# EasyEDA Pro project esp32s3-mp4.eprj

# Schematic Schematic1
Board Name: Board1; Create Date: 2025-05-05; Page Name: P1; Project Name: esp32s3-mp4; Schematic Name: Schematic1; Update Date: 2025-05-05; Company: 嘉立创EDA; Page Size: A4; Version: V1.0
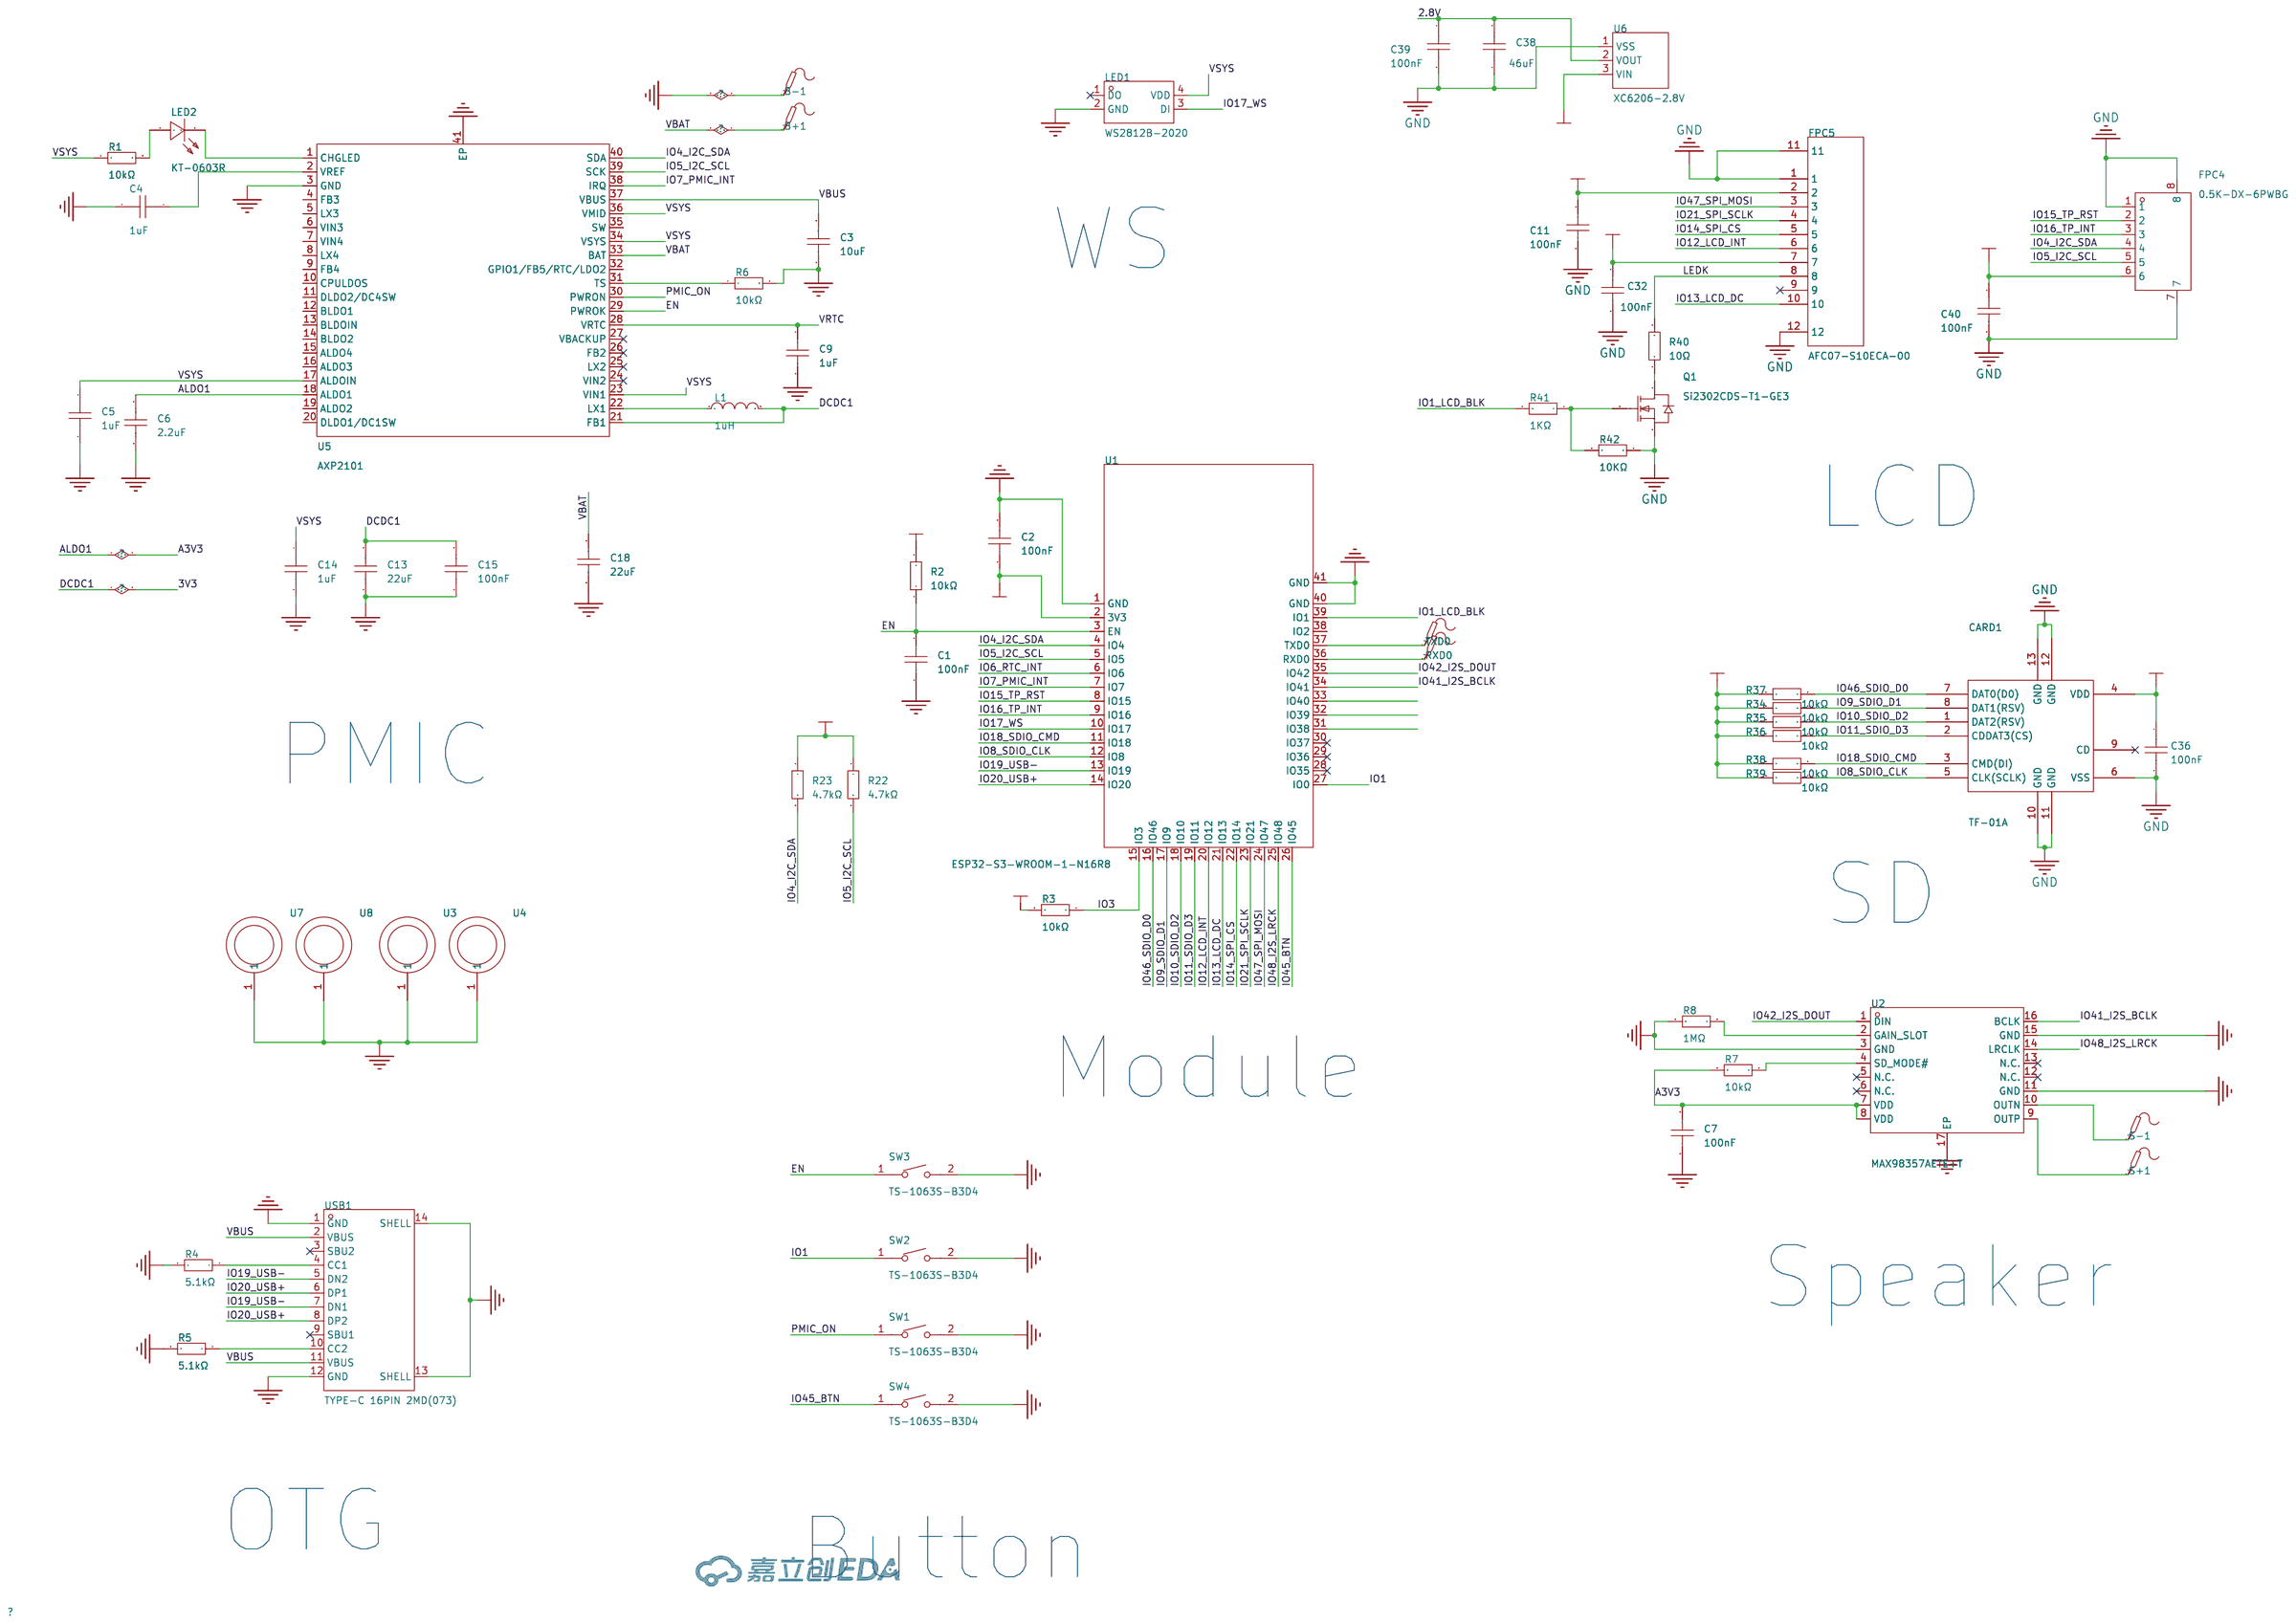
[diagram p0: schematic sheet]

## Parts
B+1  -  [Test-Point-0.5mm]
B-1  -  [Test-Point-0.5mm]
C1  100nF  [C0402]
C2  100nF  [C0402]
C3  10uF  [C0603]
C4  1uF  [C0402]
C5  1uF  [C0402]
C6  2.2uF  [C0402]
C7  100nF  [C0402]
C9  1uF  [C0402]
C11  100nF  [C0402]
C13  22uF  [C0603]
C14  1uF  [C0402]
C15  100nF  [C0402]
C18  22uF  [C0603]
C32  100nF  [C0402]
C36  100nF  [C0402]
C38  46uF  [C0603]
C39  100nF  [C0402]
C40  100nF  [C0402]
CARD1  TF-01A  [TF-SMD_TF-01A]
FPC4  0.5K-DX-6PWBG  [FPC-SMD_6P-P0.50_DEALON_0.5K-DX-6PWB]
FPC5  AFC07-S10ECA-00  [FPC-SMD_P0.50-10P_LCS-SJ-H2.0]
L1  1uH  [IND-SMD_L4.4-W4.2]
LED1  WS2812B-2020  [LED-SMD_4P-L2.0-W2.0-TL_WS2812B-2020]
LED2  KT-0603R  [LED0603-RD]
Q1  Si2302CDS-T1-GE3  [SOT-23_L2.9-W1.3-P1.90-LS2.4-BR]
R1  10kΩ  [R0402]
R2  10kΩ  [R0402]
R3  10kΩ  [R0402]
R4  5.1kΩ  [R0402]
R5  5.1kΩ  [R0402]
R6  10kΩ  [R0402]
R7  10kΩ  [R0402]
R8  1MΩ  [R0402]
R22  4.7kΩ  [R0402]
R23  4.7kΩ  [R0402]
R34  10kΩ  [R0402]
R35  10kΩ  [R0402]
R36  10kΩ  [R0402]
R37  10kΩ  [R0402]
R38  10kΩ  [R0402]
R39  10kΩ  [R0402]
R40  10Ω  [R0402]
R41  1KΩ  [R0402]
R42  10KΩ  [R0402]
RXD0  -  [Test-Point-0.5mm]
S+1  -  [Test-Point-0.5mm]
S-1  -  [Test-Point-0.5mm]
SW1  TS-1063S-B3D4  [KEY-SMD_L3.0-W2.5-LS4.0_TS-1603S]
SW2  TS-1063S-B3D4  [KEY-SMD_L3.0-W2.5-LS4.0_TS-1603S]
SW3  TS-1063S-B3D4  [KEY-SMD_L3.0-W2.5-LS4.0_TS-1603S]
SW4  TS-1063S-B3D4  [KEY-SMD_L3.0-W2.5-LS4.0_TS-1603S]
TXD0  -  [Test-Point-0.5mm]
U1  ESP32-S3-WROOM-1-N16R8  [WIRELM-SMD_ESP32-S3-WROOM-1]
U2  MAX98357AETE+T  [TQFN-16_L3.0-W3.0-P0.50-BL-EP1.5]
U3  -  [M2]
U4  -  [M2]
U5  AXP2101  [QFN-40_L5.0-W5.0-P0.40-TL-EP3.4]
U6  XC6206-2.8V  [SOT-23-3_L2.9-W1.6-P1.90-LS2.8-BR]
U7  -  [M2]
U8  -  [M2]
USB1  TYPE-C 16PIN 2MD(073)  [USB-C-SMD_TYPE-C-6PIN-2MD-073]

## Library data of the parts
B+1 B-1 RXD0 S+1 S-1 TXD0 = Test-Point: Test Point 测试点
C1 C2 C4-C7 C9 C14 C15 = CL05A105KA5NQNC: 容值:1uF;精度:±10%;额定电压:25V;材质(温度系数):X5R;; LCSC Part Name: 1uF ±10% 25V; Supplier Part: C52923; Manufacturer: SAMSUNG(三星); Supplier Footprint: 0402; JLCPCB Part Class: 基础库; Datasheet: https://atta.szlcsc.com/upload/public/pdf/source/20160218/1457707763339.pdf; Supplier: LCSC; Tolerance: ±10%; Voltage Rated: 25V; Temperature Coefficient: X5R
C3 C13 C18 C38 = CL10A226MQ8NRNC: 容值:22uF;精度:±20%;额定电压:6.3V;材质(温度系数):X5R;; LCSC Part Name: 22uF ±20% 6.3V; Supplier Part: C59461; Manufacturer: SAMSUNG(三星); Supplier Footprint: 0603; JLCPCB Part Class: 基础库; Datasheet: https://atta.szlcsc.com/upload/public/pdf/source/20160218/1457707763339.pdf; Supplier: LCSC; Tolerance: ±20%; Voltage Rated: 6.3V; Temperature Coefficient: X5R
C11 C32 C36 C39 C40 = CL05B104KO5NNNC: Capacitance: Tolerance:±10% Tolerance:±10% Voltage Rated: Temperature Coefficient:; LCSC Part Name: 100nF ±10% 16V; Supplier Part: C1525; Manufacturer: SAMSUNG(三星); Supplier Footprint: 0402; JLCPCB Part Class: Basic Part; Datasheet: https://atta.szlcsc.com/upload/public/pdf/source/20160218/1457707763339.pdf; Supplier: LCSC; Tolerance: ±10%
CARD1 = TF-01A_C91145: LCSC Part Name: 自弹式 MicroSD卡(TF卡) 卡座; Supplier Part: C91145; Manufacturer: 韩国韩荣; Supplier Footprint: SMD; JLCPCB Part Class: 扩展库; Datasheet: https://atta.szlcsc.com/upload/public/pdf/source/20190322/C91145_63CBD6FB4639A3A3EC6A9721F18AE0FB.pdf; Supplier: LCSC; Card Connection Mode: 自弹式; Card Type: MicroSD卡(TF卡); Connector Type: 卡座; Supplementary Features: 带定位柱; Maximum Body Height: 1.85mm
FPC4 = 0.5K-DX-6PWBG: LCSC Part Name: 间距:0.5mm P数:6P 翻盖式 下接; Supplier Part: C2911878; Manufacturer: HDGC(华德共创); Supplier Footprint: SMD,P=0.5mm,卧贴; JLCPCB Part Class: 扩展库; Datasheet: https://atta.szlcsc.com/upload/public/pdf/source/20211029/EDC59C5BA257836333CAE013AFC084A6.pdf; Supplier: LCSC; Locking Feature: 翻盖式; Contact Type: 下接; Number of Contacts: 6P; Pitch: 0.5mm; Mounting Type: 卧贴; FFC, FCB Thickness: 0.3mm; Height Above Board: 2mm; Operating Temperature Range: -20℃~+85℃
FPC5 = AFC07-S10ECA-00: LCSC Part Name: 间距:0.5mm P数:10P 抽屉式 上接; Supplier Part: C262583; Manufacturer: JS(钜硕电子); Supplier Footprint: SMD,P=0.5mm,卧贴; JLCPCB Part Class: 扩展库; Datasheet: https://atta.szlcsc.com/upload/public/pdf/source/20190726/C11082_A2E7B12387019CE4314BB5199EE0FDF4.pdf; Supplier: LCSC; Locking Feature: 抽屉式; Contact Type: 上接; Number of Contacts: 10P; Pitch: 0.5mm; Mounting Type: 卧贴; FFC, FCB Thickness: 0.3mm; Height Above Board: 2mm
L1 = FXL0420-2R2-M: 电感值:2.2uH;精度:±20%;额定电流:4.5A;饱和电流(Isat):5A;类型:一体成型电感;; LCSC Part Name: 2.2uH ±20% 5A; Supplier Part: C167206; Manufacturer: cjiang(长江微电); Supplier Footprint: SMD,4.2x4.4mm; JLCPCB Part Class: 扩展库; Datasheet: https://atta.szlcsc.com/upload/public/pdf/source/20240426/3189EA8206330E2108542F9E34E540E7.pdf; Supplier: LCSC; Tolerance: ±20%; Rated Current: 4.5A; Saturation Current (Isat): 5A; DC Resistance (DCR): 58mΩ; Type: 一体成型电感
LED1 = WS2812B-2020: 12mA，小尺寸，高亮，用于小间距，小尺寸产品（注意防潮，请查阅规格书中对应具体内容）; LCSC Part Name: RGB三色; Supplier Part: C965555; Manufacturer: worldsemi; Supplier Footprint: SMD,2x2mm; JLCPCB Part Class: 扩展库; Datasheet: https://atta.szlcsc.com/upload/public/pdf/source/20241202/DEE3FC25B8AD87F3BB1718ACD77EDECD.pdf; Supplier: LCSC; Wavelength: 515.6nm；622.5nm；470.4nm
LED2 = KT-0603R: 发光颜色:红色;功率:-;正向电流:-;主波长:-;二极管配置:-;透镜颜色:-;色温:-;发光角度:-;载带方式:-;工作温度:-40℃~+85℃;; LCSC Part Name: 0603 红灯 高亮; Supplier Part: C2286; Manufacturer: KENTO; Supplier Footprint: 0603; JLCPCB Part Class: 基础库; Datasheet: https://atta.szlcsc.com/upload/public/pdf/source/20160616/1466072038404.pdf; Supplier: LCSC; Emitted Color: 红色; Operating Temperature: -40℃~+85℃
Q1 = Si2302CDS-T1-GE3: LCSC Part Name: 1个N沟道 耐压:20V 电流:2.9A; Supplier Part: C10488; Manufacturer: VISHAY(威世); Supplier Footprint: SOT-23; JLCPCB Part Class: 扩展库; Datasheet: https://atta.szlcsc.com/upload/public/pdf/source/20121215/1457706570095.pdf; Supplier: LCSC; Type: 1个N沟道; Drain Source Voltage (Vdss): 20V; Continuous Drain Current (Id): 2.9A; Drain Source On Resistance (RDS(on)@Vgs,Id): 57mΩ@4.5V,3.6A; Power Dissipation (Pd): 550mW; Gate Threshold Voltage (Vgs(th)@Id): 850mV@250uA; Total Gate Charge (Qg@Vgs): 3.5nC@4.5V; Input Capacitance (Ciss@Vds): 320pF@10V; Reverse Transfer Capacitance (Crss@Vds): 5pF@10V; Operating Temperature: -55℃~+150℃
R1-R8 R22 R23 R34-R42 = 0402WGF1002TCE: 电阻类型:厚膜电阻;阻值:10kΩ;精度:±1%;功率:62.5mW;最大工作电压:50V;温度系数:±100ppm/℃;; LCSC Part Name: 10kΩ ±1% 62.5mW 厚膜电阻; Supplier Part: C25744; Manufacturer: UNI-ROYAL(厚声); Supplier Footprint: 0402; Datasheet: https://atta.szlcsc.com/upload/public/pdf/source/20200306/C422600_1E6D84923E4A46A82E41ADD87F860B5C.pdf; Supplier: LCSC; Type: 厚膜电阻; Tolerance: ±1%; Power(Watts): 62.5mW; Overload Voltage (Max): 50V; Temperature Coefficient: ±100ppm/℃; Operating Temperature Range: -55℃~+155℃
SW1-SW4 = TS-1063S-B3D4: 电路结构:单刀单掷;按钮形状:矩形按钮;作用力:250gf;安装方式:-;带灯:-;机械寿命:-;; LCSC Part Name: 轻触开关3.0*2.5侧按贴片带柱小小龟250gf; Supplier Part: C498291; Manufacturer: Yuandi(元迪); JLCPCB Part Class: 扩展库; Datasheet: https://atta.szlcsc.com/upload/public/pdf/source/20200318/C498291_A3607BD92317BA61A63F6AFAF35A0DD0.pdf; Supplier: LCSC; Circuit: 单刀单掷; Actuator Style: 矩形按钮; Operating Force: 250gf
U1 = ESP32-S3-WROOM-1-N16R8: LCSC Part Name: 通用型Wi-Fi+低功耗蓝牙MCU模组; Supplier Part: C2913202; Manufacturer: ESPRESSIF(乐鑫); Supplier Footprint: SMD,18x25.5mm; Datasheet: https://atta.szlcsc.com/upload/public/pdf/source/20220705/4E799F39581577F766659887F738A439.pdf; Supplier: LCSC
U2 = MAX98357AETE+T: 功放类型:-;扬声器通道数:单声道;输出功率:3.2Wx2@4Ω;; LCSC Part Name: 微型、低成本、PCM 类 D 级放大器具有 AB 级性能; Supplier Part: C910544; Manufacturer: ADI(亚德诺)/MAXIM(美信); Supplier Footprint: TQFN-16-EP(3x3); Datasheet: https://atta.szlcsc.com/upload/public/pdf/source/20210106/C910544_CB6DE4B2CEE254A72E6BDB40E718D281.pdf; Supplier: LCSC; Speaker Channels: 单声道; Output Power: 3.2Wx2@4Ω; Supply Voltage: 2.5V~5.5V; Operating Temperature: -40℃~+85℃
U3 U4 U7 U8 = M2
U5 = AXP2101: A PMU designed by Allwinner; Supplier Part: C3036461; Manufacturer: x-powers; Supplier Footprint: QFN-40-EP(5x5); Datasheet: https://atta.szlcsc.com/upload/public/pdf/source/20230506/27D868F447993329A9E953603DF31964.pdf; Supplier: LCSC
U6 = XC6206-2.8V: LCSC Part Name: 输入6V 输出2.8V 250mA; Supplier Part: C2892669; Manufacturer: YONGYUTAI(永裕泰); Supplier Footprint: SOT-23-3L; JLCPCB Part Class: 扩展库; Datasheet: https://atta.szlcsc.com/upload/public/pdf/source/20210901/DE3C77F0CE73FFE8F7C655BE9B94CB06.pdf; Supplier: LCSC; Output Type: 固定; Voltage - Supply: 6V; Output Voltage: 2.8V; Output Current: 250mA; Features: 短路保护(SCP)；低ESR；过流保护(OCP); Operating Temperature: -40℃~+85℃@(Tj); Output Configuration: 正极; Number of Outputs: 1
USB1 = TYPE-C 16PIN 2MD(073): 连接器类型:Type-C;标准:USB 3.1;公母:母;安装方式:卧贴;触点数量:16P;端口数量:1;额定电流 - 电源:5A;工作温度范围:-25℃~+85℃;; LCSC Part Name: Type-C 母 卧贴; Supplier Part: C2765186; Manufacturer: SHOU HAN(首韩); Supplier Footprint: SMD; JLCPCB Part Class: 扩展库; Datasheet: https://atta.szlcsc.com/upload/public/pdf/source/20211123/39B17C16241EAC15C5E277BDA434118E.pdf; Supplier: LCSC; Connector Type: Type-C; Standard: USB 3.1; Gender: 母; Mounting Style: 卧贴; Number of Contacts: 16P; Number of Ports: 1; Current Rating - Power (Max): 5A; Operating Temperature Range: -25℃~+85℃; Rated Voltage (Max): 5V; Connect-Disconnect Life: 5千次; Core Colour: 黑色

## Nets
2.8V: C11.1 C38.2 C39.1 FPC5.2 U6.2(VOUT)
3V3: C2.1 C13.2 C15.2 C32.1 C36.1 C40.1 CARD1.4(VDD) FPC4.6 FPC5.7 L1.2 R2.2 R3.2 R22.1 R23.1 R34.1 R35.2 R36.2 R37.2 R38.2 R39.2 U1.2(3V3) U5.21(FB1) U6.3(VIN)
A3V3: C6.1 C7.2 R7.2 U2.7(VDD) U2.8(VDD) U5.18(ALDO1)
GND: B-1.1 C1.1 C2.2 C3.1 C4.2 C5.2 C6.2 C7.1 C9.2 C11.2 C13.1 C14.2 C15.1 C18.1 C32.2 C36.2 C38.1 C39.2 C40.2 CARD1.6(VSS) CARD1.10(GND) CARD1.11(GND) CARD1.12(GND) CARD1.13(GND) FPC4.1 FPC4.7 FPC4.8 FPC5.1 FPC5.11 FPC5.12 LED1.2(GND) Q1.2(S) R4.2 R5.2 R6.2 R8.2 R42.1 SW1.2 SW2.2 SW3.2 SW4.2 U1.1(GND) U1.40(GND) U1.41(GND) U2.3(GND) U2.11(GND) U2.15(GND) U2.17(EP) U3.1 U4.1 U5.3(GND) U5.41(EP) U6.1(VSS) U7.1 U8.1 USB1.1(GND) USB1.12(GND) USB1.13(SHELL) USB1.14(SHELL)
VBAT: B+1.1 C18.2 U5.33(BAT)
VBUS: C3.2 U5.37(VBUS) USB1.2(VBUS) USB1.11(VBUS)
EN: C1.2 R2.1 SW3.1 U1.3(EN) U5.29(PWROK)
IO1: SW2.1 U1.27(IO0)
IO1_LCD_BLK: R41.2 U1.39(IO1)
IO3: R3.1 U1.15(IO3)
IO4_I2C_SDA: FPC4.4 R23.2 U1.4(IO4) U5.40(SDA)
IO5_I2C_SCL: FPC4.5 R22.2 U1.5(IO5) U5.39(SCK)
IO6_RTC_INT: U1.6(IO6)
IO7_PMIC_INT: U1.7(IO7) U5.38(IRQ)
IO8_SDIO_CLK: CARD1.5(CLK(SCLK)) R39.1 U1.12(IO8)
IO9_SDIO_D1: CARD1.8(DAT1(RSV)) R34.2 U1.17(IO9)
IO10_SDIO_D2: CARD1.1(DAT2(RSV)) R35.1 U1.18(IO10)
IO11_SDIO_D3: CARD1.2(CDDAT3(CS)) R36.1 U1.19(IO11)
IO12_LCD_INT: FPC5.6 U1.20(IO12)
IO13_LCD_DC: FPC5.10 U1.21(IO13)
IO14_SPI_CS: FPC5.5 U1.22(IO14)
IO15_TP_RST: FPC4.2 U1.8(IO15)
IO16_TP_INT: FPC4.3 U1.9(IO16)
IO17_WS: LED1.3(DI) U1.10(IO17)
IO18_SDIO_CMD: CARD1.3(CMD(DI)) R38.1 U1.11(IO18)
IO19_USB-: U1.13(IO19) USB1.5(DN2) USB1.7(DN1)
IO20_USB+: U1.14(IO20) USB1.6(DP1) USB1.8(DP2)
IO21_SPI_SCLK: FPC5.4 U1.23(IO21)
IO41_I2S_BCLK: U1.34(IO41) U2.16(BCLK)
IO42_I2S_DOUT: U1.35(IO42) U2.1(DIN)
IO45_BTN: SW4.1 U1.26(IO45)
IO46_SDIO_D0: CARD1.7(DAT0(D0)) R37.1 U1.16(IO46)
IO47_SPI_MOSI: FPC5.3 U1.24(IO47)
IO48_I2S_LRCK: U1.25(IO48) U2.14(LRCLK)
LEDK: FPC5.8 R40.2
PMIC_ON: SW1.1 U5.30(PWRON)
VRTC: C9.1 U5.28(VRTC)
VSYS: C5.1 C14.1 LED1.4(VDD) R1.1 U5.17(ALDOIN) U5.23(VIN1) U5.34(VSYS) U5.36(VMID)
$1N2964: LED2.1(K) U5.1(CHGLED)
$1N2965: LED2.2(A) R1.2
$1N2983: R4.1 USB1.4(CC1)
$1N2984: R5.1 USB1.10(CC2)
$1N3004: C4.1 U5.2(VREF)
$1N3006: R6.1 U5.31(TS)
$1N3020: R7.1 U2.4(SD_MODE#)
$1N3022: R8.1 U2.2(GAIN_SLOT)
$1N3138: L1.1 U5.22(LX1)
$1N3173: S-1.1 U2.10(OUTN)
$1N3174: S+1.1 U2.9(OUTP)
$1N3180: TXD0.1 U1.37(TXD0)
$1N3181: RXD0.1 U1.36(RXD0)
$1N5894: Q1.1(G) R41.1 R42.2
$1N5896: Q1.3(D) R40.1

Not connected (* = marked no-connect by the designer): CARD1 9(CD)*; FPC5 9*; LED1 1(DO)*; U1 28(IO35)* 29(IO36)* 30(IO37)* 31(IO38) 32(IO39) 33(IO40) 38(IO2); U2 5(N.C.)* 6(N.C.)* 12(N.C.)* 13(N.C.)*; U5 4(FB3) 5(LX3) 6(VIN3) 7(VIN4) 8(LX4) 9(FB4) 10(CPULDOS) 11(DLDO2/DC4SW) 12(BLDO1) 13(BLDOIN) 14(BLDO2) 15(ALDO4) 16(ALDO3) 19(ALDO2) 20(DLDO1/DC1SW) 24(VIN2)* 25(LX2)* 26(FB2)* 27(VBACKUP)* 32(GPIO1/FB5/RTC/LDO2) 35(SW); USB1 3(SBU2)* 9(SBU1)*

## Notes on the sheet
- WS
- LCD
- PMIC
- SD
- Module
- Speaker
- OTG
- Button

# Board PCB1
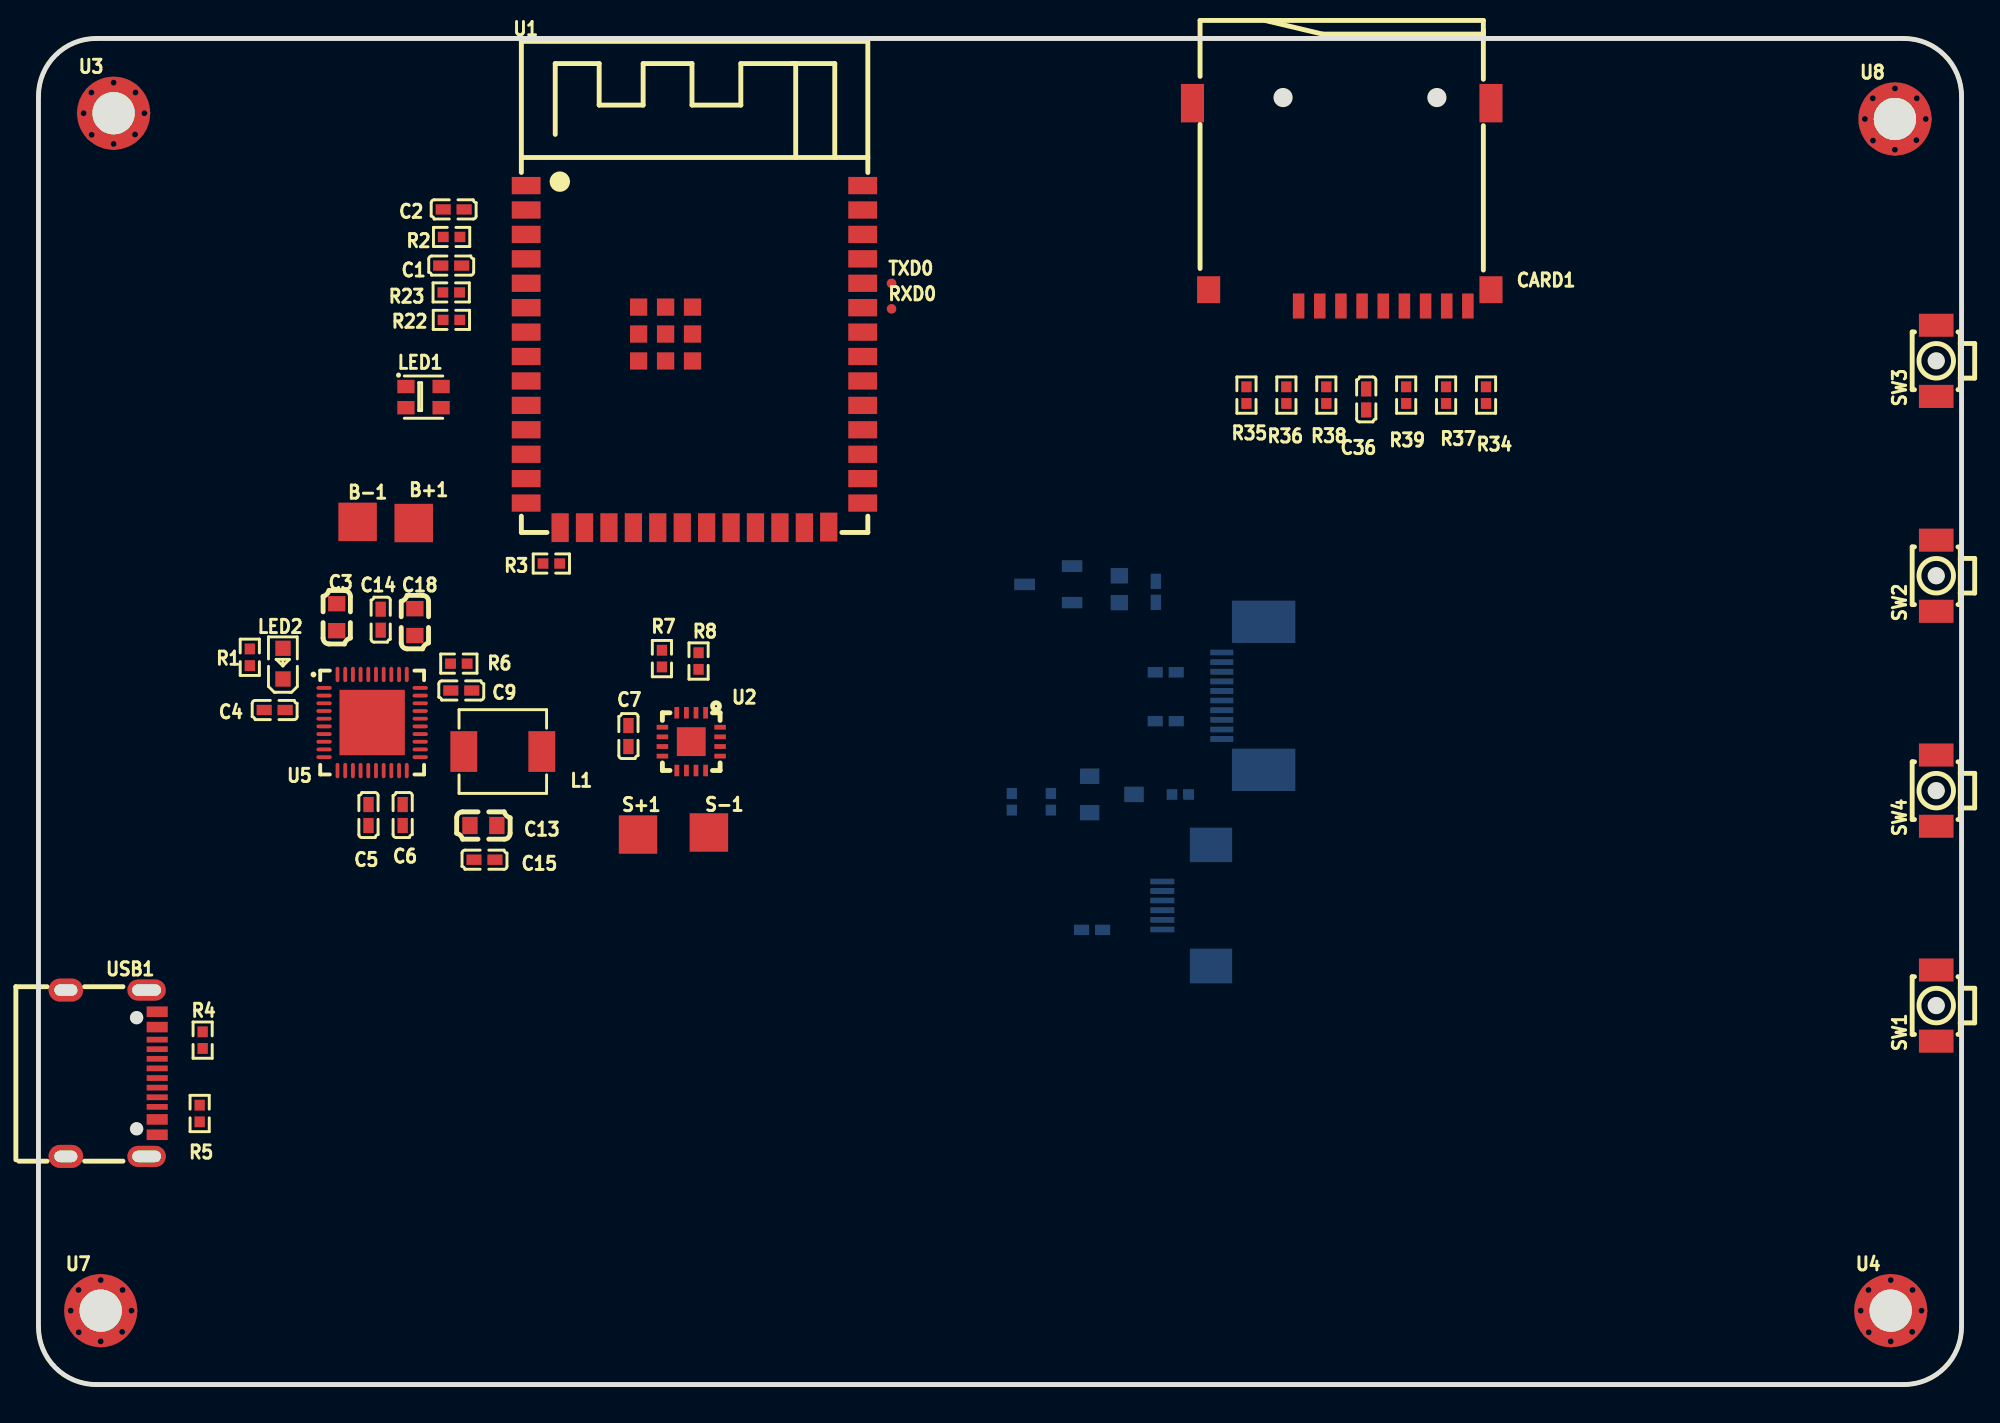
[diagram p1: board, top side]
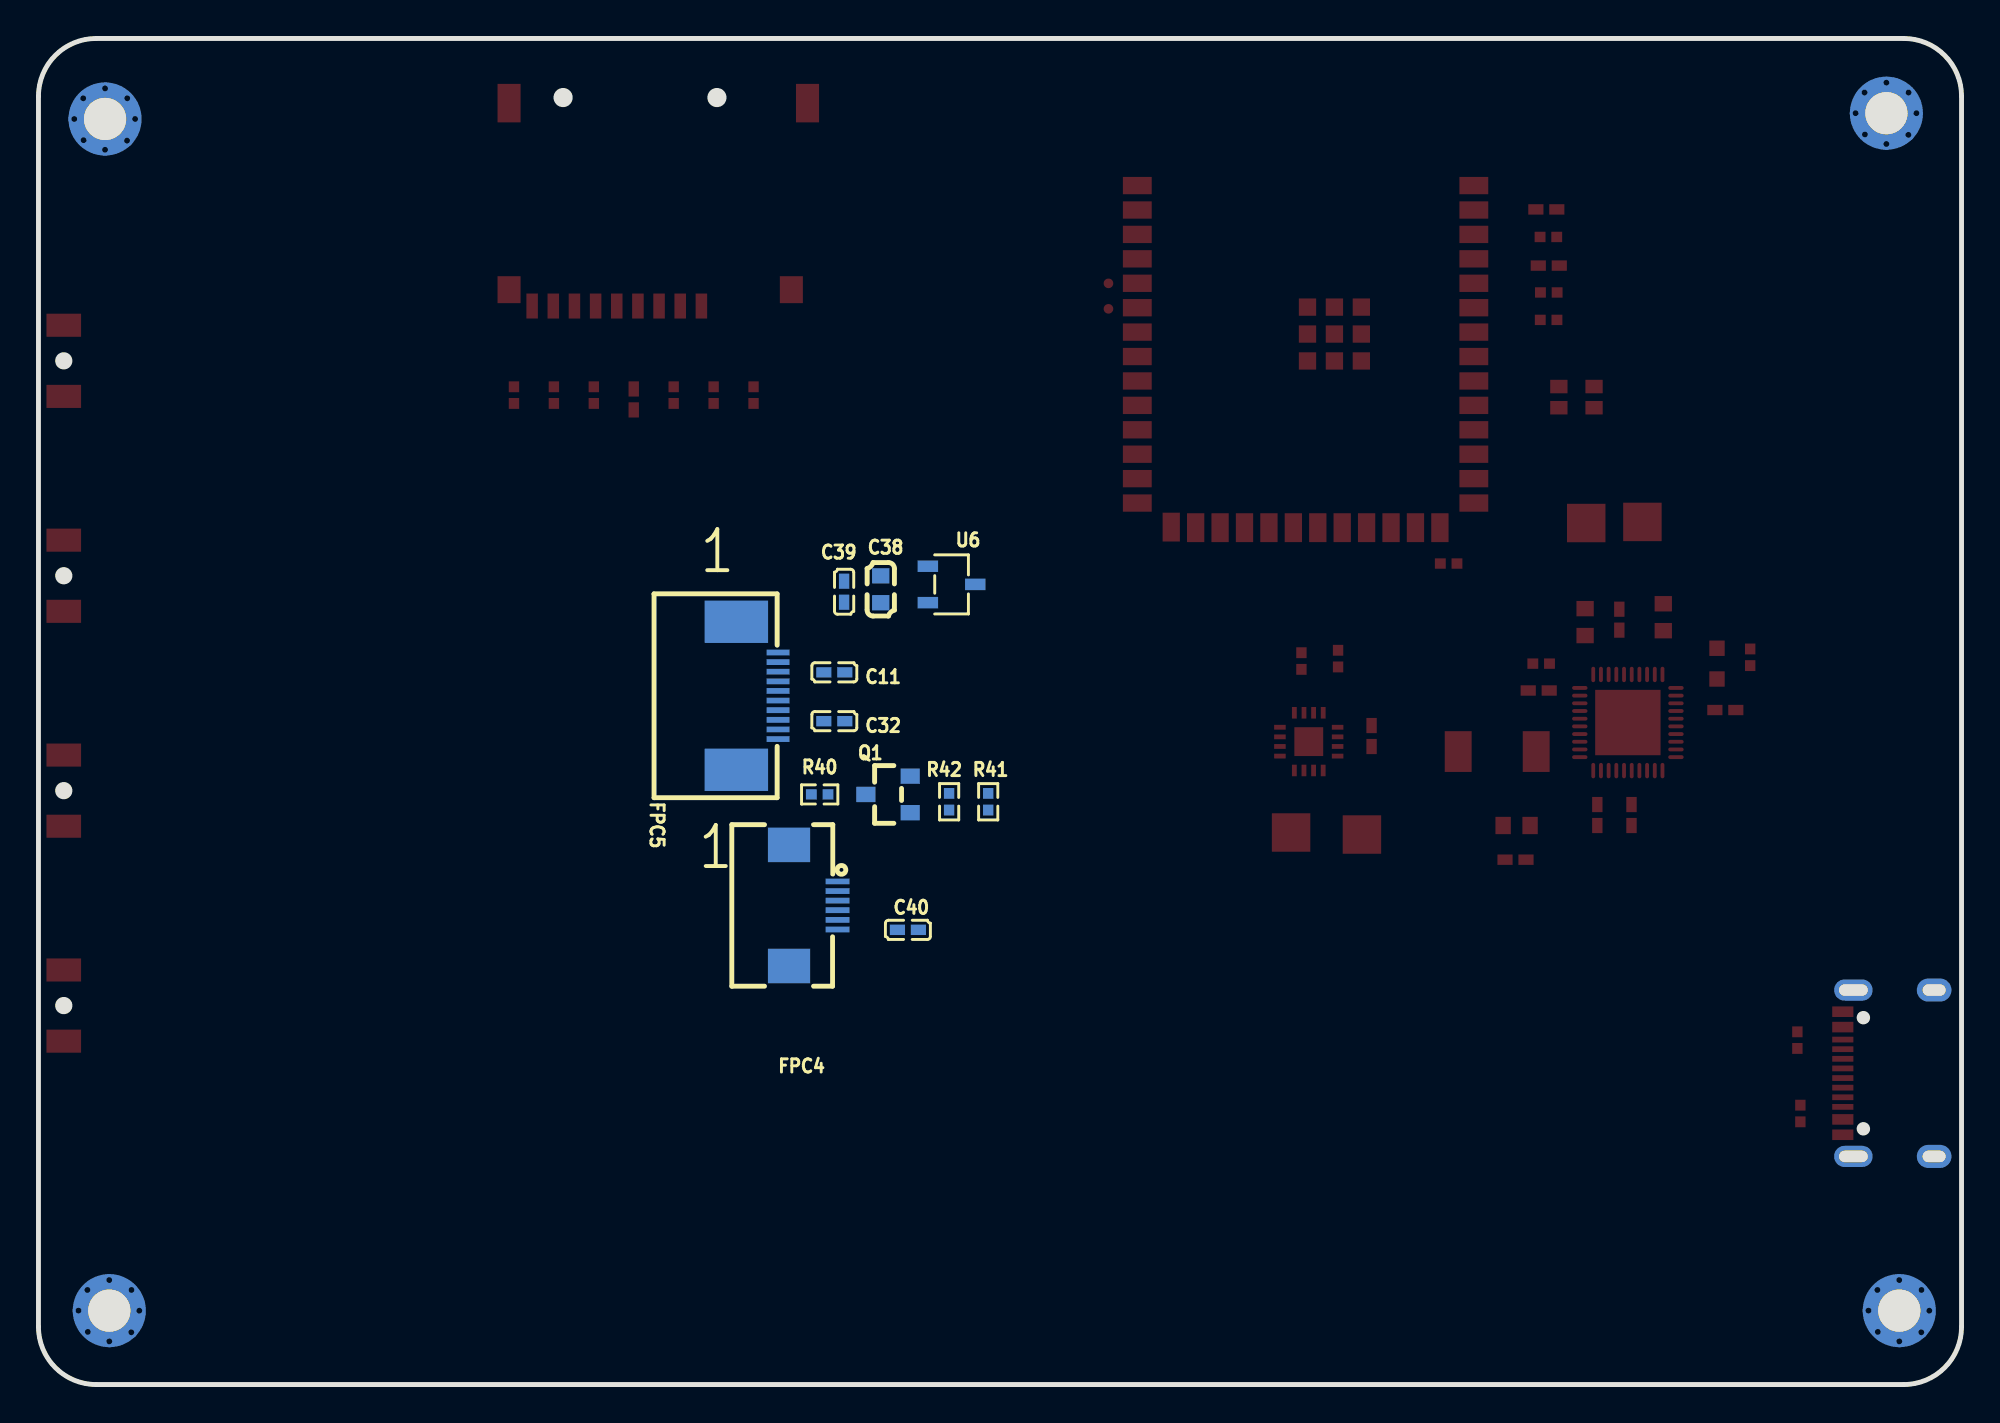
[diagram p2: board, bottom side, seen from below]

Outline 100 x 70 mm; copper layers: Top Layer, Bottom Layer. Coordinates in mm from the lower left corner of the outline.
Outline path: 0,67 0,3 arc(0.88,0.88) 3,0 97,0 arc(99.12,0.88) 100,3 100,67 arc(99.12,69.12) 97,70 3,70 arc(0.88,69.12) 0,67
Stack: Top Layer 0.035mm / Dielectric1 1.51mm FR4 er 4.5 / Bottom Layer 0.035mm

## Design rules (mm)
template: JLCPCB Capability(Two Layers Board)
spacing copperThickness1oz (default): track to track 0.102, other pairs 0.152 to 0.3
spacing copperThickness2oz: track to track 0.203, other pairs 0.152 to 0.3
track width copperThickness1oz (default): min 0.127, default 0.254, max 2.54
track width copperThickness2oz: min 0.203, default 0.254, max 2.54
differential pair differentialPair (default): width min 0.127, default 0.254, max 2.54; gap min 0.152, default 0.152
via viaSize (default): diameter min 0.5, default 0.61, max 10; hole min 0.3, default 0.305, max 6.3

## Placement (name value [footprint] x y rotation side)
B+1  -  [Test-Point-0.5mm]  19.52 44.8 0 top
B-1  -  [Test-Point-0.5mm]  16.59 44.86 0 top
C1  100nF  [C0402]  21.46 58.19 0 top
C2  100nF  [C0402]  21.59 61.11 180 top
C3  10uF  [C0603]  15.51 39.9 270 top
C4  1uF  [C0402]  12.28 35.08 180 top
C5  1uF  [C0402]  17.16 29.62 270 top
C6  2.2uF  [C0402]  18.94 29.62 270 top
C7  100nF  [C0402]  30.68 33.72 270 top
C9  1uF  [C0402]  21.99 36.09 0 top
C11  100nF  [C0402]  58.61 37.04 180 bottom
C13  22uF  [C0603]  23.14 29.07 0 top
C14  1uF  [C0402]  17.8 39.78 90 top
C15  100nF  [C0402]  23.19 27.29 0 top
C18  22uF  [C0603]  19.57 39.65 270 top
C32  100nF  [C0402]  58.61 34.5 180 bottom
C36  100nF  [C0402]  69.04 51.23 270 top
C38  46uF  [C0603]  56.2 41.36 270 bottom
C39  100nF  [C0402]  58.11 41.23 90 bottom
C40  100nF  [C0402]  54.79 23.64 180 bottom
CARD1  TF-01A  [TF-SMD_TF-01A]  67.77 61.36 180 top
FPC4  0.5K-DX-6PWBG  [FPC-SMD_6P-P0.50_DEALON_0.5K-DX-6PWB]  59.71 24.92 270 bottom
FPC5  AFC07-S10ECA-00  [FPC-SMD_P0.50-10P_LCS-SJ-H2.0]  62.62 35.82 90 bottom
L1  1uH  [IND-SMD_L4.4-W4.2]  24.15 32.92 180 top
LED1  WS2812B-2020  [LED-SMD_4P-L2.0-W2.0-TL_WS2812B-2020]  20.02 51.35 0 top
LED2  KT-0603R  [LED0603-RD]  12.72 37.49 90 top
Q1  Si2302CDS-T1-GE3  [SOT-23_L2.9-W1.3-P1.90-LS2.4-BR]  55.82 30.69 180 bottom
R1  10kΩ  [R0402]  10.99 37.82 90 top
R2  10kΩ  [R0402]  21.48 59.68 180 top
R3  10kΩ  [R0402]  26.67 42.7 180 top
R4  5.1kΩ  [R0402]  8.54 17.91 90 top
R5  5.1kΩ  [R0402]  8.38 14.09 270 top
R6  10kΩ  [R0402]  21.86 37.49 0 top
R7  10kΩ  [R0402]  32.42 37.75 90 top
R8  1MΩ  [R0402]  34.33 37.62 90 top
R22  4.7kΩ  [R0402]  21.47 55.36 0 top
R23  4.7kΩ  [R0402]  21.46 56.79 0 top
R34  10kΩ  [R0402]  75.27 51.45 270 top
R35  10kΩ  [R0402]  62.82 51.45 270 top
R36  10kΩ  [R0402]  64.89 51.45 270 top
R37  10kΩ  [R0402]  73.2 51.45 270 top
R38  10kΩ  [R0402]  66.97 51.45 270 top
R39  10kΩ  [R0402]  71.12 51.45 270 top
R40  10Ω  [R0402]  59.38 30.69 0 bottom
R41  1KΩ  [R0402]  50.61 30.31 90 bottom
R42  10KΩ  [R0402]  52.64 30.31 270 bottom
RXD0  -  [Test-Point-0.5mm#2]  44.36 55.94 0 top
S+1  -  [Test-Point-0.5mm]  31.18 28.6 0 top
S-1  -  [Test-Point-0.5mm]  34.86 28.71 0 top
SW1  TS-1063S-B3D4  [KEY-SMD_L3.0-W2.5-LS4.0_TS-1603S]  98.68 19.71 90 top
SW2  TS-1063S-B3D4  [KEY-SMD_L3.0-W2.5-LS4.0_TS-1603S]  98.68 42.06 90 top
SW3  TS-1063S-B3D4  [KEY-SMD_L3.0-W2.5-LS4.0_TS-1603S]  98.68 53.24 90 top
SW4  TS-1063S-B3D4  [KEY-SMD_L3.0-W2.5-LS4.0_TS-1603S]  98.68 30.88 90 top
TXD0  -  [Test-Point-0.5mm#2]  44.36 57.26 0 top
U1  ESP32-S3-WROOM-1-N16R8  [WIRELM-SMD_ESP32-S3-WROOM-1]  34.11 53.45 0 top
U2  MAX98357AETE+T  [TQFN-16_L3.0-W3.0-P0.50-BL-EP1.5]  33.94 33.43 180 top
U3  -  [M2]  3.91 66.11 0 top
U4  -  [M2]  96.32 3.84 0 top
U5  AXP2101  [QFN-40_L5.0-W5.0-P0.40-TL-EP3.4]  17.35 34.43 0 top
U6  XC6206-2.8V  [SOT-23-3_L2.9-W1.6-P1.90-LS2.8-BR]  52.52 41.61 0 bottom
U7  -  [M2]  3.24 3.84 0 top
U8  -  [M2]  96.54 65.81 0 top
USB1  TYPE-C 16PIN 2MD(073)  [USB-C-SMD_TYPE-C-6PIN-2MD-073]  3.8 16.19 270 top

## Footprints (pads in the part's own frame, mm; a bottom-side part is the same pattern mirrored in y, then rotated)
C0402
  rect 0.79x0.54 smd: 1(-0.545,0) 2(0.545,0)
C0603
  rect 0.8x0.9 smd: 1(-0.7,0) 2(0.7,0)
FPC-SMD_6P-P0.50_DEALON_0.5K-DX-6PWB
  rect 0.3x1.25 smd: 1(-1.25,1.262) 2(-0.75,1.262) 3(-0.25,1.262) 4(0.25,1.262) 5(0.75,1.262) 6(1.25,1.262)
  rect 1.8x2.2 smd: 7(3.15,-1.262) 8(-3.15,-1.262)
FPC-SMD_P0.50-10P_LCS-SJ-H2.0
  rect 0.3x1.2 smd: 1(2.25,-1.085) 2(1.75,-1.085) 3(1.25,-1.085) 4(0.75,-1.085) 5(0.25,-1.085) 6(-0.25,-1.085) 7(-0.75,-1.085) 8(-1.25,-1.085) 9(-1.75,-1.085) 10(-2.25,-1.085)
  rect 2.2x3.3 smd: 11(-3.85,1.085) 12(3.85,1.085)
IND-SMD_L4.4-W4.2
  rect 1.4x2.12 smd: 1(2.028,0) 2(-2.028,0)
KEY-SMD_L3.0-W2.5-LS4.0_TS-1603S
  rect 1.2x1.8 smd: 1(-1.85,0) 2(1.85,0)
LED0603-RD
  rect 0.8x0.8 smd: 1(-0.799,0) 2(0.799,0)
LED-SMD_4P-L2.0-W2.0-TL_WS2812B-2020
  rect 0.9x0.7 smd: 1(-0.915,0.55) 2(-0.915,-0.55) 3(0.915,-0.55) 4(0.915,0.55)
M2
  round 3.8 hole 2.2: 1(0,0)
QFN-40_L5.0-W5.0-P0.40-TL-EP3.4
  oval 0.8x0.2 smd: 1(-2.5,1.8) 2(-2.5,1.4) 3(-2.5,1) 4(-2.5,0.6) 5(-2.5,0.2) 6(-2.5,-0.2) 7(-2.5,-0.6) 8(-2.5,-1) 9(-2.5,-1.4) 10(-2.5,-1.8) 21(2.5,-1.8) 22(2.5,-1.4) 23(2.5,-1) 24(2.5,-0.6) 25(2.5,-0.2) 26(2.5,0.2) 27(2.5,0.6) 28(2.5,1) 29(2.5,1.4) 30(2.5,1.8)
  oval 0.2x0.8 smd: 11(-1.8,-2.5) 12(-1.4,-2.5) 13(-1,-2.5) 14(-0.6,-2.5) 15(-0.2,-2.5) 16(0.2,-2.5) 17(0.6,-2.5) 18(1,-2.5) 19(1.4,-2.5) 20(1.8,-2.5) 31(1.8,2.5) 32(1.4,2.5) 33(1,2.5) 34(0.6,2.5) 35(0.2,2.5) 36(-0.2,2.5) 37(-0.6,2.5) 38(-1,2.5) 39(-1.4,2.5) 40(-1.8,2.5)
  rect 3.4x3.4 smd: 41(0,0)
R0402
  rect 0.566x0.54 smd: 1(-0.433,0) 2(0.433,0)
SOT-23-3_L2.9-W1.6-P1.90-LS2.8-BR
  rect 1.07x0.6 smd: 1(1.235,-0.95) 2(1.235,0.95) 3(-1.235,0)
SOT-23_L2.9-W1.3-P1.90-LS2.4-BR
  rect 1x0.8 smd: 1(1.15,-0.95) 2(1.15,0.95) 3(-1.15,0)
Test-Point-0.5mm
  rect 2x2 smd: 1(0,0)
Test-Point-0.5mm#2
  round 0.5 smd: 1(0,0)
TF-SMD_TF-01A
  rect 0.6x1.3 smd: 1(2.24,5.276) 2(1.14,5.276) 3(0.04,5.276) 4(-1.06,5.276) 5(-2.16,5.276) 6(-3.26,5.276) 7(-4.36,5.276) 8(-5.46,5.276) 9(-6.56,5.276)
  rect 1.2x1.4 smd: 10(-7.76,4.426) 13(6.92,4.426)
  rect 1.2x2 smd: 11(-7.76,-5.276) 12(7.76,-5.276)
TQFN-16_L3.0-W3.0-P0.50-BL-EP1.5
  rect 0.25x0.6 smd: 1(-0.749,-1.5) 2(-0.248,-1.5) 3(0.252,-1.5) 4(0.751,-1.5) 9(0.75,1.5) 10(0.25,1.5) 11(-0.25,1.5) 12(-0.749,1.5)
  rect 0.6x0.25 smd: 5(1.5,-0.748) 6(1.5,-0.248) 7(1.5,0.252) 8(1.5,0.752) 13(-1.5,0.752) 14(-1.5,0.252) 15(-1.5,-0.248) 16(-1.5,-0.748)
  rect 1.5x1.5 smd: 17(0,0)
USB-C-SMD_TYPE-C-6PIN-2MD-073
  rect 0.55x1.1 smd: 1(-3.2,2.375) 2(-2.4,2.375) 11(2.4,2.375) 12(3.2,2.375)
  rect 0.3x1.1 smd: 3(-1.75,2.375) 4(-1.25,2.375) 5(-0.75,2.375) 6(-0.25,2.375) 7(0.25,2.375) 8(0.75,2.375) 9(1.25,2.375) 10(1.75,2.375)
  oval 1.1x2 hole 0.6x1.5: 13(-4.325,1.825) 14(4.325,1.825)
  oval 1.2x1.8 hole 0.6x1.2: 13(-4.325,-2.375) 14(4.325,-2.375)
WIRELM-SMD_ESP32-S3-WROOM-1
  rect 1.5x0.9 smd: 1(-8.75,8.895) 2(-8.75,7.625) 3(-8.75,6.355) 4(-8.75,5.085) 5(-8.75,3.815) 6(-8.75,2.545) 7(-8.75,1.275) 8(-8.75,0.005) 9(-8.75,-1.265) 10(-8.75,-2.535) 11(-8.75,-3.805) 12(-8.75,-5.075) 13(-8.75,-6.345) 14(-8.75,-7.615) 27(8.75,-7.615) 28(8.75,-6.345) 29(8.75,-5.075) 30(8.75,-3.805) 31(8.75,-2.535) 32(8.75,-1.265) 33(8.75,0.005) 34(8.75,1.275) 35(8.75,2.545) 36(8.75,3.815) 37(8.75,5.085) 38(8.75,6.355) 39(8.75,7.625) 40(8.75,8.895)
  rect 0.9x1.5 smd: 15(-6.985,-8.895) 16(-5.715,-8.895) 17(-4.445,-8.895) 18(-3.175,-8.895) 19(-1.905,-8.895) 20(-0.635,-8.895) 21(0.635,-8.895) 22(1.905,-8.895) 23(3.175,-8.895) 24(4.445,-8.895) 25(5.715,-8.895) 26(6.985,-8.865)
  rect 0.9x0.9 smd: 41(-2.9,2.575) 41(-2.9,1.175) 41(-2.9,-0.225) 41(-1.5,2.575) 41(-1.5,1.175) 41(-1.5,-0.225) 41(-0.1,2.575) 41(-0.1,1.175) 41(-0.1,-0.225)

## Nets
As in the schematic.

Pads without a net: CARD1 9; FPC5 9; LED1 1; U1 28 29 30 38; U2 5 6 12 13; U5 4 5 6 7 8 9 10 11 12 13 14 15 16 19 20 24 25 26 27 32 35; USB1 3 9

## Via types
v1: diameter 0.61, hole 0.305, Top Layer to Bottom Layer, 32 vias

## Routing (per net, layer and track width the routed paths; a pad name or vN(x,y) marks a point on that pad's centre or on a via; arc(x,y) is an arc through that point)
GND:
  vias: v1(1.68,3.84) v1(2.08,4.92) v1(2.09,2.72) v1(2.35,66.11) v1(2.75,67.19) v1(2.76,64.99) v1(3.24,5.43) v1(3.24,2.24) v1(3.91,67.7) v1(3.91,64.51) v1(4.37,4.92) v1(4.35,2.74) v1(4.84,3.84) v1(5.04,67.19) v1(5.02,65.01) v1(5.51,66.11) v1(94.76,3.84) v1(94.98,65.81) v1(95.16,4.92) v1(95.17,2.72) v1(95.38,66.89) v1(95.39,64.69) v1(96.32,5.43) v1(96.32,2.24) v1(96.54,67.4) v1(96.54,64.21) v1(97.45,4.92) v1(97.43,2.74) v1(97.67,66.89) v1(97.65,64.71) v1(97.92,3.84) v1(98.14,65.81)

## Text on the board
Bottom Silkscreen Layer: 1
